# Altium project Thunderscope_Rev2.PrjPCB
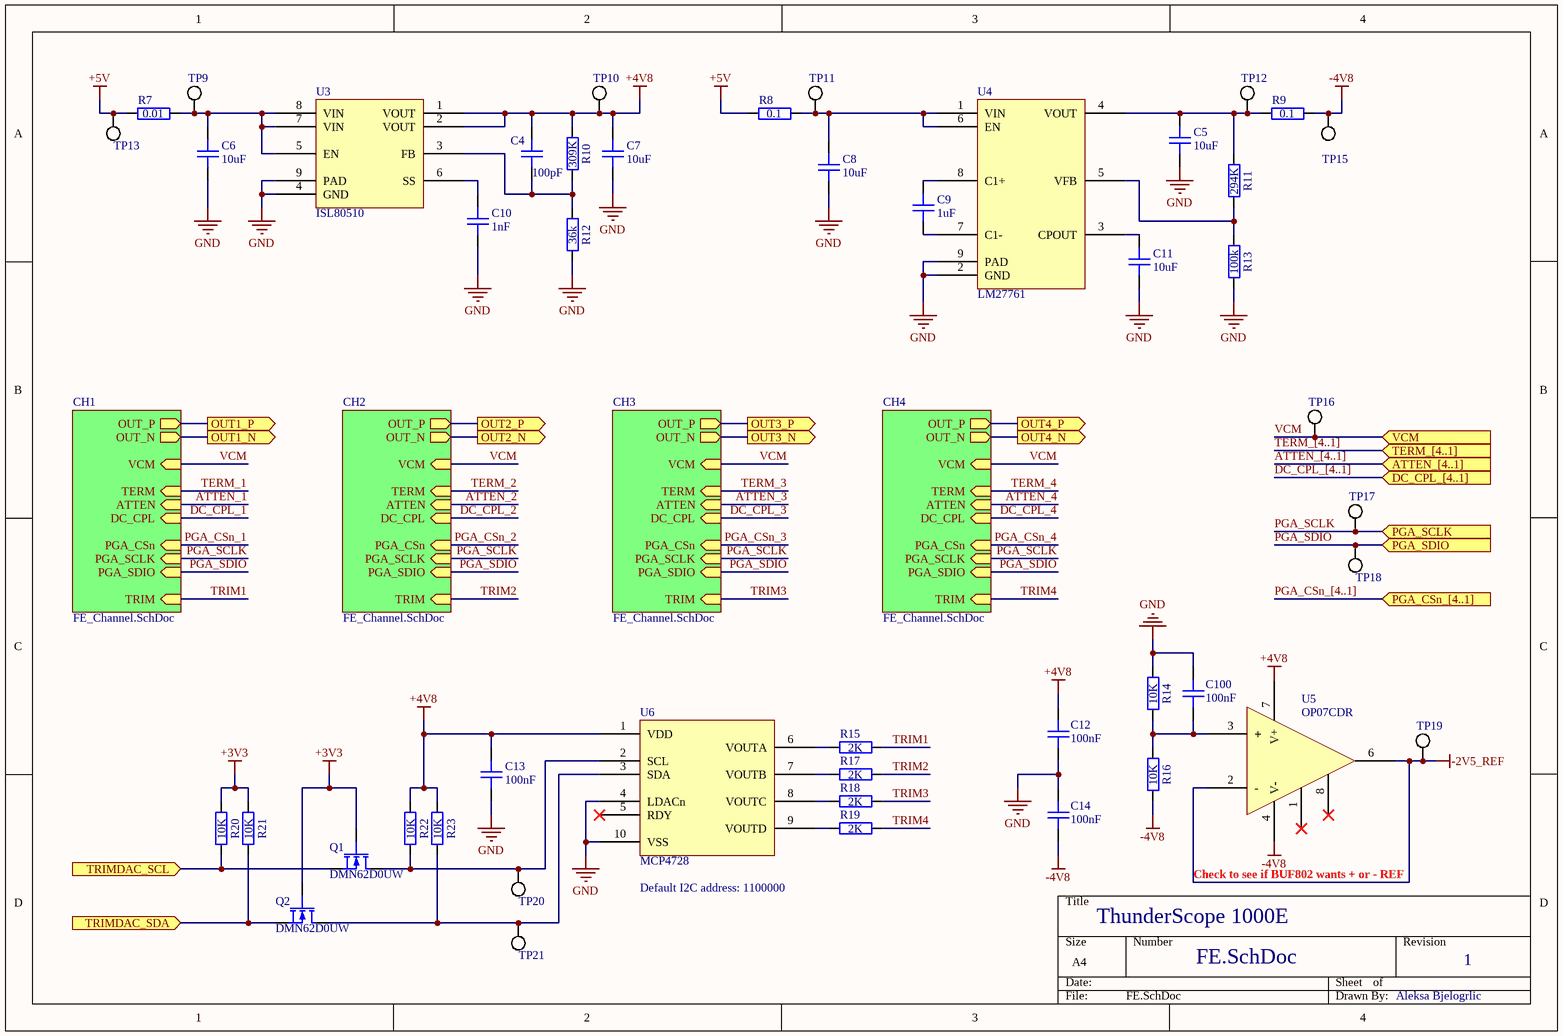
[diagram p0: FE.SchDoc]
Template Notes: - Nominal values used, dimensions in mm  - The mounting holes and keep-out areas around them are only required when the I/O bracket is mounted on the card directly  - Component height rule and clearance rule derived from PCI_Express_CEM_r2.0.pdf, Page 84.  - Stackup is not specified in PCI_Express_CEM_r2.0.pdf, nor implemented in this template.; Template Revision Date: Oct 29, 2010; Template Source Document: Outline:PCI_Express_CEM_r2.0.pdf  Pinout:PCI_Express_CEM_r2.0.pdf; Template Source Organization: PCI-SIG; Template Source Revision Date: R2.0, April 11, 2007; Template Source URL: http://www.pcisig.com; Title: ThunderScope 1000E
4 sheets, 440 parts. Net scope: hierarchical (ports join the sheet entries above them; power ports are global).
Board file: Thunderscope_Rev2.PCBDOC
Sheets:
  FE.SchDoc
    CH1 = FE_Channel.SchDoc
    CH2 = FE_Channel.SchDoc
    CH3 = FE_Channel.SchDoc
    CH4 = FE_Channel.SchDoc
  ADC.SchDoc
  M2_KEY_M.SchDoc

## Sheet FE.SchDoc: ThunderScope 1000E
size A4; Revision: 1

### Parts
C4  100pF  [GEN_C_0402]
C5  10uF  [GEN_C_0603]
C6  10uF  [GEN_C_0603]
C7  10uF  [GEN_C_0603]
C8  10uF  [GEN_C_0603]
C9  1uF  [GEN_C_0402]
C10  1nF  [GEN_C_0402]
C11  10uF  [GEN_C_0603]
C12  100nF  [GEN_C_0402]
C13  100nF  [GEN_C_0402]
C14  100nF  [GEN_C_0402]
C100  100nF  [GEN_C_0402]
Q1  DMN62D0UW  [GEN_SOT_323]
Q2  DMN62D0UW  [GEN_SOT_323]
R7  0.01  [GEN_R_0603]
R8  0.1  [GEN_R_0402]
R9  0.1  [GEN_R_0402]
R10  309K  [GEN_R_0402]
R11  294K  [GEN_R_0402]
R12  36k  [GEN_R_0402]
R13  100k  [GEN_R_0402]
R14  10K  [GEN_R_0402]
R15  2K  [GEN_R_0402]
R16  10K  [GEN_R_0402]
R17  2K  [GEN_R_0402]
R18  2K  [GEN_R_0402]
R19  2K  [GEN_R_0402]
R20  10K  [GEN_R_0402]
R21  10K  [GEN_R_0402]
R22  10K  [GEN_R_0402]
R23  10K  [GEN_R_0402]
TP9  PCB  [GEN_TP_PCB]  (value not drawn)  (no BOM)
TP10  PCB  [GEN_TP_PCB]  (value not drawn)  (no BOM)
TP11  PCB  [GEN_TP_PCB]  (value not drawn)  (no BOM)
TP12  PCB  [GEN_TP_PCB]  (value not drawn)  (no BOM)
TP13  PCB  [GEN_TP_PCB]  (value not drawn)  (no BOM)
TP15  PCB  [GEN_TP_PCB]  (value not drawn)  (no BOM)
TP16  PCB  [GEN_TP_PCB]  (value not drawn)  (no BOM)
TP17  PCB  [GEN_TP_PCB]  (value not drawn)  (no BOM)
TP18  PCB  [GEN_TP_PCB]  (value not drawn)  (no BOM)
TP19  PCB  [GEN_TP_PCB]  (value not drawn)  (no BOM)
TP20  PCB  [GEN_TP_PCB]  (value not drawn)  (no BOM)
TP21  PCB  [GEN_TP_PCB]  (value not drawn)  (no BOM)
U3  ISL80510  [REN_DFN_ISL80510]
U4  LM27761  [TI_WSON8_DSG0008A]
U5  OP07CDR  [TI_SOIC8_D0008A]
U6  MCP4728  [MC_MSOP10_UN]

### Sub-sheets
CH1 = FE_Channel.SchDoc: OUT_P (out), VCM (in), OUT_N (out), TRIM (in), ATTEN (in), DC_CPL (in), PGA_CSn (in), PGA_SCLK (in), PGA_SDIO (in), TERM (in)
CH2 = FE_Channel.SchDoc: OUT_P (out), VCM (in), OUT_N (out), TRIM (in), ATTEN (in), DC_CPL (in), PGA_CSn (in), PGA_SCLK (in), PGA_SDIO (in), TERM (in)
CH3 = FE_Channel.SchDoc: OUT_P (out), VCM (in), OUT_N (out), TRIM (in), ATTEN (in), DC_CPL (in), PGA_CSn (in), PGA_SCLK (in), PGA_SDIO (in), TERM (in)
CH4 = FE_Channel.SchDoc: OUT_P (out), VCM (in), OUT_N (out), TRIM (in), ATTEN (in), DC_CPL (in), PGA_CSn (in), PGA_SCLK (in), PGA_SDIO (in), TERM (in)

### Ports
ATTEN_[4..1] (in), DC_CPL_[4..1] (in), OUT1_N (out), OUT1_P (out), OUT2_N (out), OUT2_P (out), OUT3_N (out), OUT3_P (out), OUT4_N (out), OUT4_P (out), PGA_CSn_[4..1] (in), PGA_SCLK (in), PGA_SDIO (in), TERM_[4..1] (in), TRIMDAC_SCL (in), TRIMDAC_SDA (in), VCM (in)

### Nets
+3V3: Q1.2(G) Q2.2(G) R20.2 R21.2
+4V8: C4.2 C7.2 C12.1 C13.2 R10.2 R22.2 R23.2 TP10.1 U3.1(VOUT) U3.2(VOUT) U5.7(V+) U6.1(VDD)
+5V: R7.1 R8.1 TP13.1
-2V5_REF: TP19.1 U5.2(-) U5.6(OUT)
-4V8: C14.2 R9.2 R16.1 TP15.1 U5.4(V-)
GND: C5.1 C6.1 C7.1 C8.1 C10.1 C11.1 C12.2 C13.1 C14.1 C100.1 R12.1 R13.1 R14.2 U3.4(GND) U3.9(PAD) U4.2(GND) U4.9(PAD) U6.4(LDACn) U6.10(VSS)
OUT1_N: port OUT1_N, sheet CH1/OUT_N
OUT1_P: port OUT1_P, sheet CH1/OUT_P
OUT2_N: port OUT2_N, sheet CH2/OUT_N
OUT2_P: port OUT2_P, sheet CH2/OUT_P
OUT3_N: port OUT3_N, sheet CH3/OUT_N
OUT3_P: port OUT3_P, sheet CH3/OUT_P
OUT4_N: port OUT4_N, sheet CH4/OUT_N
OUT4_P: port OUT4_P, sheet CH4/OUT_P
PGA_SCLK: TP17.1 ; port PGA_SCLK, sheet CH1/PGA_SCLK, sheet CH2/PGA_SCLK, sheet CH3/PGA_SCLK, sheet CH4/PGA_SCLK
PGA_SDIO: TP18.1 ; port PGA_SDIO, sheet CH1/PGA_SDIO, sheet CH2/PGA_SDIO, sheet CH3/PGA_SDIO, sheet CH4/PGA_SDIO
TRIM1: R15.1 ; sheet CH1/TRIM
TRIM2: R17.1 ; sheet CH2/TRIM
TRIM3: R18.1 ; sheet CH3/TRIM
TRIM4: R19.1 ; sheet CH4/TRIM
TRIMDAC_SCL: Q1.3(S) R20.1 ; port TRIMDAC_SCL
TRIMDAC_SDA: Q2.3(S) R21.1 ; port TRIMDAC_SDA
VCM: TP16.1 ; port VCM, sheet CH1/VCM, sheet CH2/VCM, sheet CH3/VCM, sheet CH4/VCM
NetC4_1: C4.1 R10.1 R12.2 U3.3(FB)
NetC5_2: C5.2 R9.1 R11.2 TP12.1 U4.4(VOUT)
NetC6_2: C6.2 R7.2 TP9.1 U3.5(EN) U3.7(VIN) U3.8(VIN)
NetC8_2: C8.2 R8.2 TP11.1 U4.1(VIN) U4.6(EN)
NetC9_1: C9.1 U4.7(C1-)
NetC9_2: C9.2 U4.8(C1+)
NetC10_2: C10.2 U3.6(SS)
NetC11_2: C11.2 U4.3(CPOUT)
NetC100_2: C100.2 R14.1 R16.2 U5.3(+)
NetQ1_1: Q1.1(D) R22.1 TP20.1 U6.2(SCL)
NetQ2_1: Q2.1(D) R23.1 TP21.1 U6.3(SDA)
NetR11_1: R11.1 R13.2 U4.5(VFB)
NetR15_2: R15.2 U6.6(VOUTA)
NetR17_2: R17.2 U6.7(VOUTB)
NetR18_2: R18.2 U6.8(VOUTC)
NetR19_2: R19.2 U6.9(VOUTD)

Not connected (* = marked no-connect by the designer): U5 1(N1)* 8(N2)*; U6 5(RDY)*

### Buses and harness runs
bus ATTEN_[4..1] = port ATTEN_[4..1]
bus DC_CPL_[4..1] = port DC_CPL_[4..1]
bus PGA_CSn_[4..1] = port PGA_CSn_[4..1]
bus TERM_[4..1] = port TERM_[4..1]

### Notes on the sheet
- Default I2C address: 1100000
- Check to see if BUF802 wants + or - REF
- Aleksa Bjelogrlic

### Library data of the parts
C4 = CAP 100pF 50V C0G 0402: Temperature Coefficient: C0G; Voltage Rating: 50V; Package: 0402; Value: 100pF; Supplier 1: Digi-Key; Supplier Part Number 1: 490-14349-1-ND
C5-C8 C11 = CAP 10uF 10V X5R 0603: Voltage Rating: 10V; Package: 0402; Supplier 1: Digi-Key; Supplier Part Number 1: 490-10474-1-ND; Value: 10uF
C9 = CAP 1uF 25V X5R 0402: Voltage Rating: 25V; Package: 0402; Supplier 1: Digi-Key; Supplier Part Number 1: 490-10017-1-ND; Value: 1uF
C10 = CAP 1nF 50V C0G 0402: Voltage Rating: 50V; Package: 0402; Supplier 1: Digi-Key; Supplier Part Number 1: 490-6189-1-ND; Value: 1nF
C12-C14 C100 = CAP 100nF 16V X7R 0402: Voltage Rating: 16V; Package: 0402; Supplier 1: Digi-Key; Supplier Part Number 1: 490-4759-1-ND; Value: 100nF
Q1 Q2 = NMOS DMN62D0UW: Vdss: 60V; Id: 340mA; Max Power: 320mW; Supplier 1: Digi-Key; Supplier Part Number 1: DMN62D0UW-7DICT-ND
R7 = RES 0.01 OHM 1% 1/4W 0603: Tolerance: 1%; Power Rating: 0.25W; Supplier 1: Digi-Key; Supplier Part Number 1: 408-1404-1-ND; Value: 0.01; Package: 0603
R8 R9 = RES 0.1 OHM 1% 1/6W 0402: Tolerance: 1%; Power Rating: 0.16W; Package: 0402; Supplier 1: Digi-Key; Supplier Part Number 1: P.10AKCT-ND; Value: 0.1
R10 = RES 309K OHM 1% 1/16W 0402: Tolerance: 1%; Power Rating: 0.0625W; Package: 0402; Value: 309K; Supplier 1: Digi-Key; Supplier Part Number 1: YAG3108CT-ND
R11 = RES 294K OHM 1% 1/16W 0402: Tolerance: 1%; Power Rating: 0.0625W; Package: 0402; Supplier 1: Digi-Key; Supplier Part Number 1: YAG3092CT-ND; Value: 294K
R12 = RES 36K OHM 1% 1/16W 0402: Tolerance: 1%; Power Rating: 0.0625W; Package: 0402; Value: 36k; Supplier 1: Digi-Key; Supplier Part Number 1: 311-36.0KLRCT-ND
R13 = RES 100K OHM 1% 1/10W 0402: Tolerance: 1%; Power Rating: 0.1W; Package: 0402; Supplier 1: Digi-Key; Supplier Part Number 1: 311-100KLRCT-ND; Value: 100k
R14 R16 R20-R23 = RES 10K OHM 1% 1/10W 0402: Tolerance: 1%; Power Rating: 0.1W; Package: 0402; Supplier 1: Digi-Key; Supplier Part Number 1: P10.0KLCT-ND; Value: 10K
R15 R17-R19 = RES 2K OHM 1% 1/16W 0402: Tolerance: 1%; Power Rating: 0.0625W; Package: 0402; Supplier 1: Digi-Key; Supplier Part Number 1: 311-2KLRCT-ND; Value: 2K
TP9-TP13 TP15-TP21 = TP PCB 1mm
U3 = IC LDO ISL80510: Supplier 1: Mouser; Supplier Part Number 1: 968-ISL80510IRAJZ-T7
U4 = IC CPUMP LM27761: Supplier 1: Digi-Key; Supplier Part Number 1: 296-44379-1-ND
U5 = IC OPAMP OP07CDR: Supplier 1: Digi-Key; Supplier Part Number 1: 296-14626-1-ND
U6 = IC DAC QUAD MCP4728: Supplier 1: Digi-Key; Supplier Part Number 1: MCP4728A1T-E/UNCT-ND

## Sheet FE_Channel.SchDoc: ThunderScope 1000E
size A4; DrawnBy: Aleksa Bjelogrlic; Revision: 1
Used 4 times, as channels CH1, CH2, CH3, CH4. Parts and nets are listed once, with the designators drawn on the sheet.
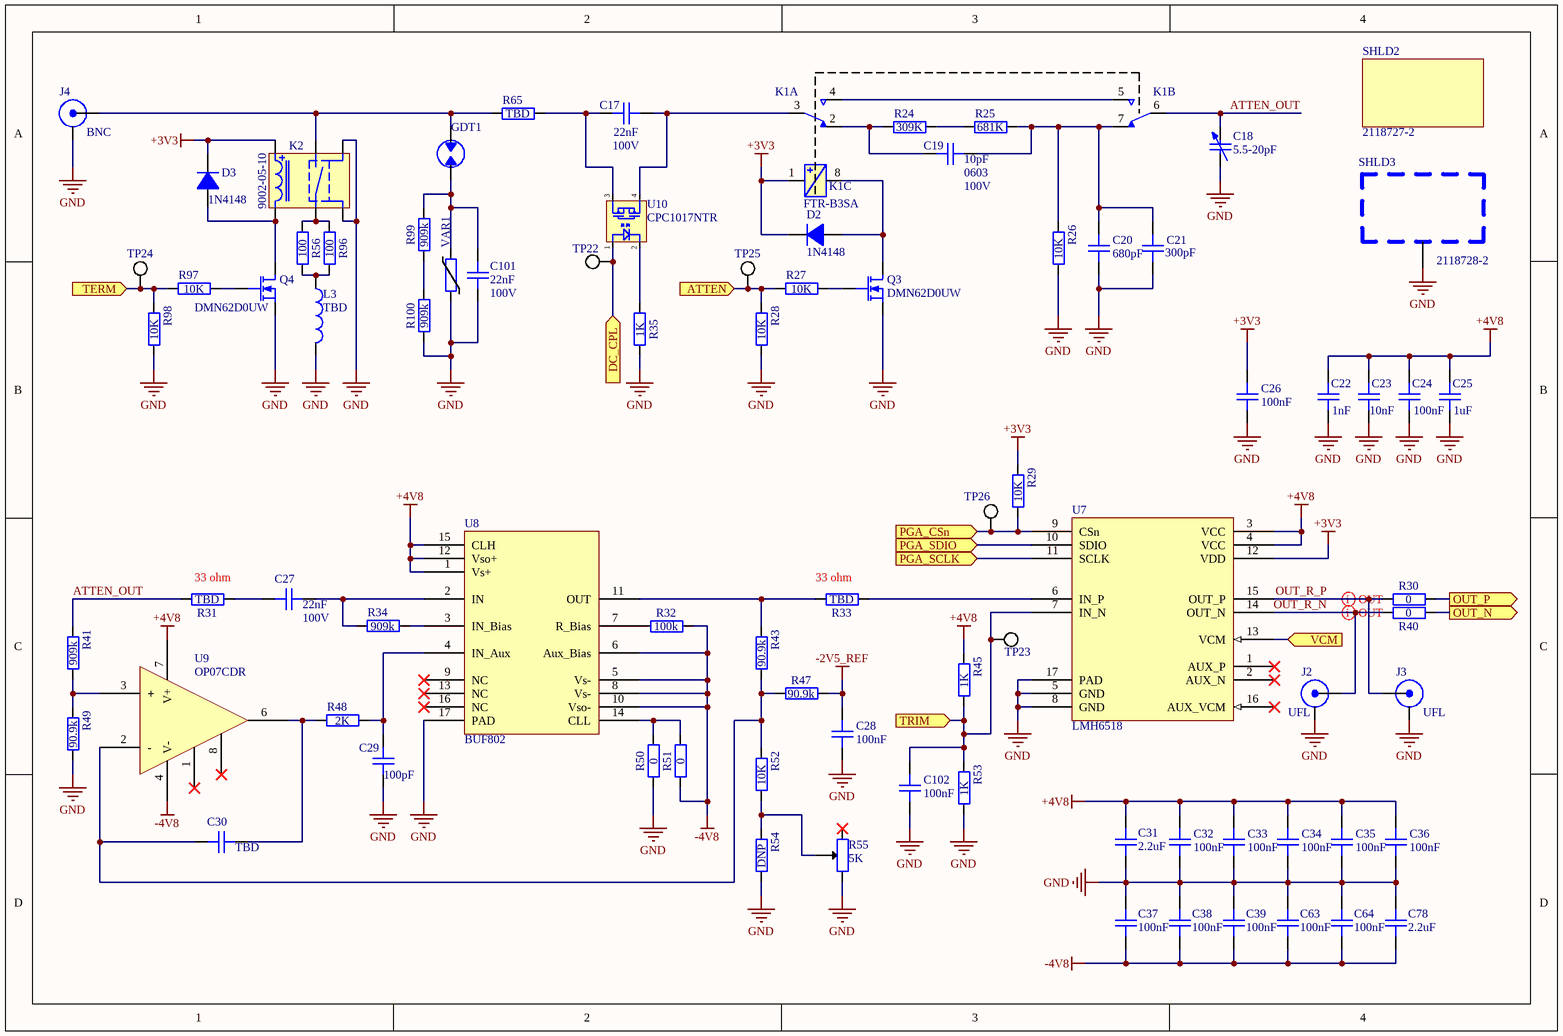
[diagram p1: FE_Channel.SchDoc]

### Parts
C17  22nF  Voltage Rating: 100V  [GEN_C_0603]
C18  5.5-20pF  [EW_TRIMCAP]
C19  10pF  Package: 0603  Voltage Rating: 100V  [GEN_C_0603]
C20  680pF  [GEN_C_0402]
C21  300pF  [GEN_C_0402]
C22  1nF  [GEN_C_0402]
C23  10nF  [GEN_C_0402]
C24  100nF  [GEN_C_0402]
C25  1uF  [GEN_C_0402]
C26  100nF  [GEN_C_0402]
C27  22nF  Voltage Rating: 100V  [GEN_C_0603]
C28  100nF  [GEN_C_0402]
C29  100pF  [GEN_C_0402]
C30  TBD  [GEN_C_0402]
C31  2.2uF  [GEN_C_0402]
C32  100nF  [GEN_C_0402]
C33  100nF  [GEN_C_0402]
C34  100nF  [GEN_C_0402]
C35  100nF  [GEN_C_0402]
C36  100nF  [GEN_C_0402]
C37  100nF  [GEN_C_0402]
C38  100nF  [GEN_C_0402]
C39  100nF  [GEN_C_0402]
C63  100nF  [GEN_C_0402]
C64  100nF  [GEN_C_0402]
C78  2.2uF  [GEN_C_0402]
C101  22nF  Voltage Rating: 100V  [GEN_C_0603]
C102  100nF  [GEN_C_0402]
D2  1N4148  [GEN_SOD_323]
D3  1N4148  [GEN_SOD_323]
GDT1  4532-075-LF  [BOU_2051]  (value not drawn)
J2  UFL  [TE_2334884-1]
J3  UFL  [TE_2334884-1]
J4  BNC  [MOL_0731000105]
K1  FTR-B3SA  [FUJ_FTR-B3SA]  (value not drawn)  (parts A,B,C of 3)
K2  9002-05-10  [COTO_9002-05-10]
L3  TBD  [GEN_L_0402]
Q3  DMN62D0UW  [GEN_SOT_323]
Q4  DMN62D0UW  [GEN_SOT_323]
R24  309K  [GEN_R_0402]
R25  681K  [GEN_R_0402]
R26  10K  [GEN_R_0402]
R27  10K  [GEN_R_0402]
R28  10K  [GEN_R_0402]
R29  10K  [GEN_R_0402]
R30  0  [GEN_R_0402]
R31  TBD  [GEN_R_0402]  (no BOM)
R32  100k  [GEN_R_0402]
R33  TBD  [GEN_R_0402]  (no BOM)
R34  909k  [GEN_R_0402]
R35  1K  [GEN_R_0402]
R40  0  [GEN_R_0402]
R41  909k  [GEN_R_0402]
R43  90.9k  [GEN_R_0402]
R45  1K  [GEN_R_0402]
R47  90.9k  [GEN_R_0402]
R48  2K  [GEN_R_0402]
R49  90.9k  [GEN_R_0402]
R50  0  [GEN_R_0402]
R51  0  [GEN_R_0402]
R52  10K  [GEN_R_0402]
R53  1K  [GEN_R_0402]
R54  DNP  [GEN_R_0402]  (no BOM)
R55  5K  [BOU_3mm_POT]
R56  100  [GEN_R_0402]
R65  TBD  [GEN_R_0603]
R96  100  [GEN_R_0402]
R97  10K  [GEN_R_0402]
R98  10K  [GEN_R_0402]
R99  909k  [GEN_R_0402]
R100  909k  [GEN_R_0402]
SHLD2  2118727-2  (mechanical)
SHLD3  2118728-2  [TE_2118728-2]
TP22  PCB  [GEN_TP_PCB]  (value not drawn)  (no BOM)
TP23  PCB  [GEN_TP_PCB]  (value not drawn)  (no BOM)
TP24  PCB  [GEN_TP_PCB]  (value not drawn)  (no BOM)
TP25  PCB  [GEN_TP_PCB]  (value not drawn)  (no BOM)
TP26  PCB  [GEN_TP_PCB]  (value not drawn)  (no BOM)
U7  LMH6518  [TI_WQFN_RGH0016A]
U8  BUF802  [TI_VQFN_RGT0016C]
U9  OP07CDR  [TI_SOIC8_D0008A]
U10  CPC1017NTR  [IXY_CPC1017]
VAR1  ZV40K1210251NIR1HT  [GEN_VAR_1210]  (value not drawn)

### Ports
ATTEN (in), DC_CPL (in), OUT_N (out), OUT_P (out), PGA_CSn (in), PGA_SCLK (in), PGA_SDIO (in), TERM (in), TRIM (in), VCM (in)

### Nets
+3V3: C26.2 D2.1(K) D3.1(K) K1.1 K2.2 R29.2 U7.12(VDD)
+4V8: C22.2 C23.2 C24.2 C25.2 C31.2 C32.1 C33.1 C34.1 C35.2 C36.2 R45.2 U7.3(VCC) U7.4(VCC) U8.1(Vs+) U8.12(Vso+) U8.15(CLH) U9.7(V+)
-2V5_REF: C28.1 R47.1
-4V8: C37.2 C38.2 C39.1 C63.1 C64.1 C78.2 R32.2 R51.1 U8.5(Vs-) U8.6(Aux_Bias) U8.8(Vs-) U8.10(Vso-) U9.4(V-)
GND: C18.2 C20.1 C21.1 C22.1 C23.1 C24.1 C25.1 C26.1 C28.2 C29.1 C31.1 C32.2 C33.2 C34.2 C35.1 C36.1 C37.1 C38.1 C39.2 C63.2 C64.2 C78.1 C101.2 C102.2 J2.2(SHIELD) J3.2(SHIELD) J4.2(SHIELD) K2.5 K2.6 L3.2 Q3.3(S) Q4.3(S) R26.1 R28.1 R35.1 R49.1 R50.1 R53.1 R54.1 R55.3 R98.1 R100.1 SHLD3.1 U7.5(GND) U7.8(GND) U7.17(PAD) U8.17(PAD) VAR1.1
ATTEN: R27.2 R28.2 TP25.1 ; port ATTEN
ATTEN_OUT: C18.1 K1.6 R31.1 R41.2
DC_CPL: TP22.1 U10.1 ; port DC_CPL
OUT_N: R40.2 ; port OUT_N
OUT_P: R30.2 ; port OUT_P
OUT_R_N: J2.1(Signal) R40.1 U7.14(OUT_N)
OUT_R_P: J3.1(Signal) R30.1 U7.15(OUT_P)
PGA_CSn: R29.1 TP26.1 U7.9(CSn) ; port PGA_CSn
PGA_SCLK: U7.11(SCLK) ; port PGA_SCLK
PGA_SDIO: U7.10(SDIO) ; port PGA_SDIO
TERM: R97.2 R98.2 TP24.1 ; port TERM
TRIM: C102.1 R45.1 R53.2 TP23.1 U7.7(IN_N) ; port TRIM
VCM: U7.13(VCM) ; port VCM
NetC17_1: C17.1 K1.3 U10.4
NetC17_2: C17.2 R65.2 U10.3
NetC19_1: C19.1 C20.2 C21.2 K1.7 R25.2 R26.2
NetC19_2: C19.2 K1.2 R24.1
NetC27_1: C27.1 R34.2 U8.2(IN)
NetC27_2: C27.2 R31.2
NetC29_2: C29.2 R48.1 U8.4(IN_Aux)
NetC30_1: C30.1 R48.2 U9.6(OUT)
NetC30_2: C30.2 R43.1 R47.2 R52.2 U9.2(-)
NetC101_1: C101.1 GDT1.2 R99.2 VAR1.2
NetD2_2: D2.2(A) K1.8 Q3.1(D)
NetD3_2: D3.2(A) K2.3 Q4.1(D)
NetGDT1_1: GDT1.1 J4.1(Signal) K2.1 R65.1
NetK1_4: K1.4 K1.5
NetK2_4: K2.4 R56.2 R96.2
NetL3_1: L3.1 R56.1 R96.1
NetQ3_2: Q3.2(G) R27.1
NetQ4_2: Q4.2(G) R97.1
NetR24_2: R24.2 R25.1
NetR32_1: R32.1 U8.7(R_Bias)
NetR33_1: R33.1 R43.2 U8.11(OUT)
NetR33_2: R33.2 U7.6(IN_P)
NetR34_1: R34.1 U8.3(IN_Bias)
NetR35_2: R35.2 U10.2
NetR41_1: R41.1 R49.2 U9.3(+)
NetR50_2: R50.2 R51.2 U8.14(CLL)
NetR52_1: R52.1 R54.2 R55.2
NetR99_1: R99.1 R100.2

Not connected (* = marked no-connect by the designer): R55 1*; U7 1(AUX_P)* 2(AUX_N)* 16(AUX_VCM)*; U8 9(NC)* 13(NC)* 16(NC)*; U9 1(N1)* 8(N2)*

### Channels
CH1: designators end in A; ports ATTEN=ATTEN_1 DC_CPL=DC_CPL_1 OUT_N=OUT1_N OUT_P=OUT1_P PGA_CSn=PGA_CSn_1 PGA_SCLK=PGA_SCLK PGA_SDIO=PGA_SDIO TERM=TERM_1 TRIM=TRIM1 VCM=VCM
CH2: designators end in B; ports ATTEN=ATTEN_2 DC_CPL=DC_CPL_2 OUT_N=OUT2_N OUT_P=OUT2_P PGA_CSn=PGA_CSn_2 PGA_SCLK=PGA_SCLK PGA_SDIO=PGA_SDIO TERM=TERM_2 TRIM=TRIM2 VCM=VCM
CH3: designators end in C; ports ATTEN=ATTEN_3 DC_CPL=DC_CPL_3 OUT_N=OUT3_N OUT_P=OUT3_P PGA_CSn=PGA_CSn_3 PGA_SCLK=PGA_SCLK PGA_SDIO=PGA_SDIO TERM=TERM_3 TRIM=TRIM3 VCM=VCM
CH4: designators end in D; ports ATTEN=ATTEN_4 DC_CPL=DC_CPL_4 OUT_N=OUT4_N OUT_P=OUT4_P PGA_CSn=PGA_CSn_4 PGA_SCLK=PGA_SCLK PGA_SDIO=PGA_SDIO TERM=TERM_4 TRIM=TRIM4 VCM=VCM

### Layout directives
differential pair; differential pair class 100Z_Diff_PGA: OUT_R_N_CH1, OUT_R_P_CH1

### Notes on the sheet
- (near R31) 33 ohm
- (near R33) 33 ohm

### Library data of the parts
C17 C27 C101 = CAP 22nF 100V X7R 0603: Package: 0603; Supplier 1: Digi-Key; Supplier Part Number 1: 490-4782-1-ND; Value: 22nF
C18 = CAP TRIMMER 5.5-20PF 500V: Value: 5.5-20pF; Supplier 1: Digikey; Supplier Part Number 1: 2447-SGC3S200NMCT-ND
C19 = CAP 10pF 100V C0G 0603: Supplier 1: Digi-Key; Supplier Part Number 1: 478-5769-1-ND; Value: 10pF
C20 = CAP 680pF 50V C0G 0402: Voltage Rating: 50V; Temperature Coefficient: C0G; Package: 0402; Supplier 1: Digi-Key; Supplier Part Number 1: 490-16439-1-ND; Value: 680pF
C21 = CAP 300pF 50V C0G 0402: Voltage Rating: 50V; Temperature Coefficient: C0G; Package: 0402; Supplier 1: Digi-Key; Supplier Part Number 1: 490-GCM1555C1H301FA16DCT-ND; Value: 300pF
C22 = CAP 1nF 50V C0G 0402: Voltage Rating: 50V; Package: 0402; Supplier 1: Digi-Key; Supplier Part Number 1: 490-6189-1-ND; Value: 1nF
C23 = CAP 10nF 50V X7R 0402: Voltage Rating: 50V; Package: 0402; Supplier 1: Digi-Key; Supplier Part Number 1: 490-6351-1-ND; Value: 10nF
C24 C26 C28 C32-C39 C63 C64 C102 = CAP 100nF 16V X7R 0402: Voltage Rating: 16V; Package: 0402; Supplier 1: Digi-Key; Supplier Part Number 1: 490-4759-1-ND; Value: 100nF
C25 = CAP 1uF 25V X5R 0402: Voltage Rating: 25V; Package: 0402; Supplier 1: Digi-Key; Supplier Part Number 1: 490-10017-1-ND; Value: 1uF
C29 = CAP 100pF 50V C0G 0402: as C4 on sheet FE; Package: 0402; Value: 100pF; Supplier 1: Digi-Key; Supplier Part Number 1: 490-14349-1-ND
C30 = CAP TBD 0402: Package: 0402; Value: TBD
C31 C78 = CAP 2.2uF 10V X5R 0402: Voltage Rating: 10V; Package: 0402; Supplier 1: Digi-Key; Supplier Part Number 1: 587-3153-1-ND; Value: 2.2uF
D2 D3 = DIODE 1N4148: Max Reverse Voltage: 75V; Max Current: 150mA; Supplier 1: Digi-Key; Supplier Part Number 1: 1N4148WS-FDICT-ND
GDT1 = GDT 75V 1812: Supplier 1: Digi-Key; Supplier Part Number 1: YAG6774CT-ND
J2 J3 = UFL Jack SMD: Supplier 1: Digi-Key; Supplier Part Number 1: A145155CT-ND
J4 = BNC JACK R/A: Supplier 1: Digi-Key; Supplier Part Number 1: WM5524-ND
K1 = RELAY DPDT-NO FTR-B3SA: Supplier 1: Mouser; Supplier Part Number 1: 817-FTR-B3SA003Z
K2 = RELAY RF SPST-NO 9002-05-10: Supplier 1: Newark; Supplier Part Number 1: 11J0051
L3 = IND TBD 0402: Value: TBD
Q3 Q4 = NMOS DMN62D0UW: Vdss: 60V; Id: 340mA; Max Power: 320mW; Supplier 1: Digi-Key; Supplier Part Number 1: DMN62D0UW-7DICT-ND
R24 = RES 309K OHM 1% 1/16W 0402: Tolerance: 1%; Power Rating: 0.0625W; Package: 0402; Supplier 1: Digi-Key; Supplier Part Number 1: YAG3108CT-ND; Value: 309K
R25 = RES 681K OHM 1% 1/16W 0402: Tolerance: 1%; Power Rating: 0.0625W; Package: 0402; Supplier 1: Digi-Key; Supplier Part Number 1: YAG3212CT-ND; Value: 681K
R26-R29 R52 R97 R98 = RES 10K OHM 1% 1/10W 0402: Tolerance: 1%; Power Rating: 0.1W; Package: 0402; Supplier 1: Digi-Key; Supplier Part Number 1: P10.0KLCT-ND; Value: 10K
R30 R40 R50 R51 = RES 0 OHM 1/16W 0402: Power Rating: 0.0625W; Package: 0402; Supplier 1: Digi-Key; Supplier Part Number 1: 311-0.0JRCT-ND; Value: 0
R31 R33 = RES TBD 0402: Tolerance: 1%; Power Rating: 0.0625W; Package: 0402; Value: TBD
R32 = RES 100K OHM 1% 1/10W 0402: Tolerance: 1%; Power Rating: 0.1W; Package: 0402; Value: 100k; Supplier 1: Digi-Key; Supplier Part Number 1: 311-100KLRCT-ND
R34 R41 R99 R100 = RES 909K OHM 1% 1/16W 0402: Tolerance: 1%; Power Rating: 0.0625W; Package: 0402; Supplier 1: Digi-Key; Supplier Part Number 1: YAG2377CT-ND; Value: 909k
R35 R45 R53 = RES 1K OHM 1% 1/10W 0402: Tolerance: 1%; Power Rating: 0.1W; Package: 0402; Supplier 1: Digi-Key; Supplier Part Number 1: 311-1.00KLRCT-ND; Value: 1K
R43 R47 R49 = RES 90.9K OHM 1% 1/16W 0402: Tolerance: 1%; Power Rating: 0.0625W; Package: 0402; Supplier 1: Digi-Key; Supplier Part Number 1: 311-90.9KLRCT-ND; Value: 90.9k
R48 = RES 2K OHM 1% 1/16W 0402: Tolerance: 1%; Power Rating: 0.0625W; Package: 0402; Supplier 1: Digi-Key; Supplier Part Number 1: 311-2KLRCT-ND; Value: 2K
R54 = RES DNP 0402: Tolerance: 1%; Power Rating: 0.0625W; Package: 0402; Value: DNP
R55 = TRIMMER 5K OHM 0.1W J LEAD TOP: Tolerance: 1%; Power Rating: 0.1W; Supplier 1: Digi-Key; Supplier Part Number 1: TC33X-502ECT-ND; Value: 5K
R56 R96 = RES 100 OHM 1% 1/10W 0402: Tolerance: 1%; Power Rating: 0.1W; Package: 0402; Value: 100; Supplier 1: Digi-Key; Supplier Part Number 1: 2019-RK73H1ETTP1000FCT-ND
R65 = RES TBD 0603: Value: TBD; Package: 0603
SHLD2 = SHIELD 2118727-2: Supplier 1: Digi-Key; Supplier Part Number 1: A126132-ND
SHLD3 = SHIELD 2118728-2: Supplier 1: Digi-Key; Supplier Part Number 1: A126158CT-ND
TP22-TP26 = TP PCB 1mm
U7 = IC PGA LMH6518: Supplier 1: Digi-Key; Supplier Part Number 1: LMH6518SQE/NOPBCT-ND
U8 = IC BUFFER AMP BUF802: Supplier 1: Mouser; Supplier Part Number 1: 595-BUF802IRGTR
U9 = IC OPAMP OP07CDR: Supplier 1: Digi-Key; Supplier Part Number 1: 296-14626-1-ND
U10 = SSR CPC1017NTR: Supplier 1: Digi-Key; Supplier Part Number 1: CLA233CT-ND
VAR1 = VARISTOR 68V 250A 1210: Supplier 1: Digi-Key; Supplier Part Number 1: 118-ZV40K1210251NIR1HTCT-ND

## Sheet ADC.SchDoc: ThunderScope 1000E
size A4; DrawnBy: Aleksa Bjelogrlic; Revision: 1
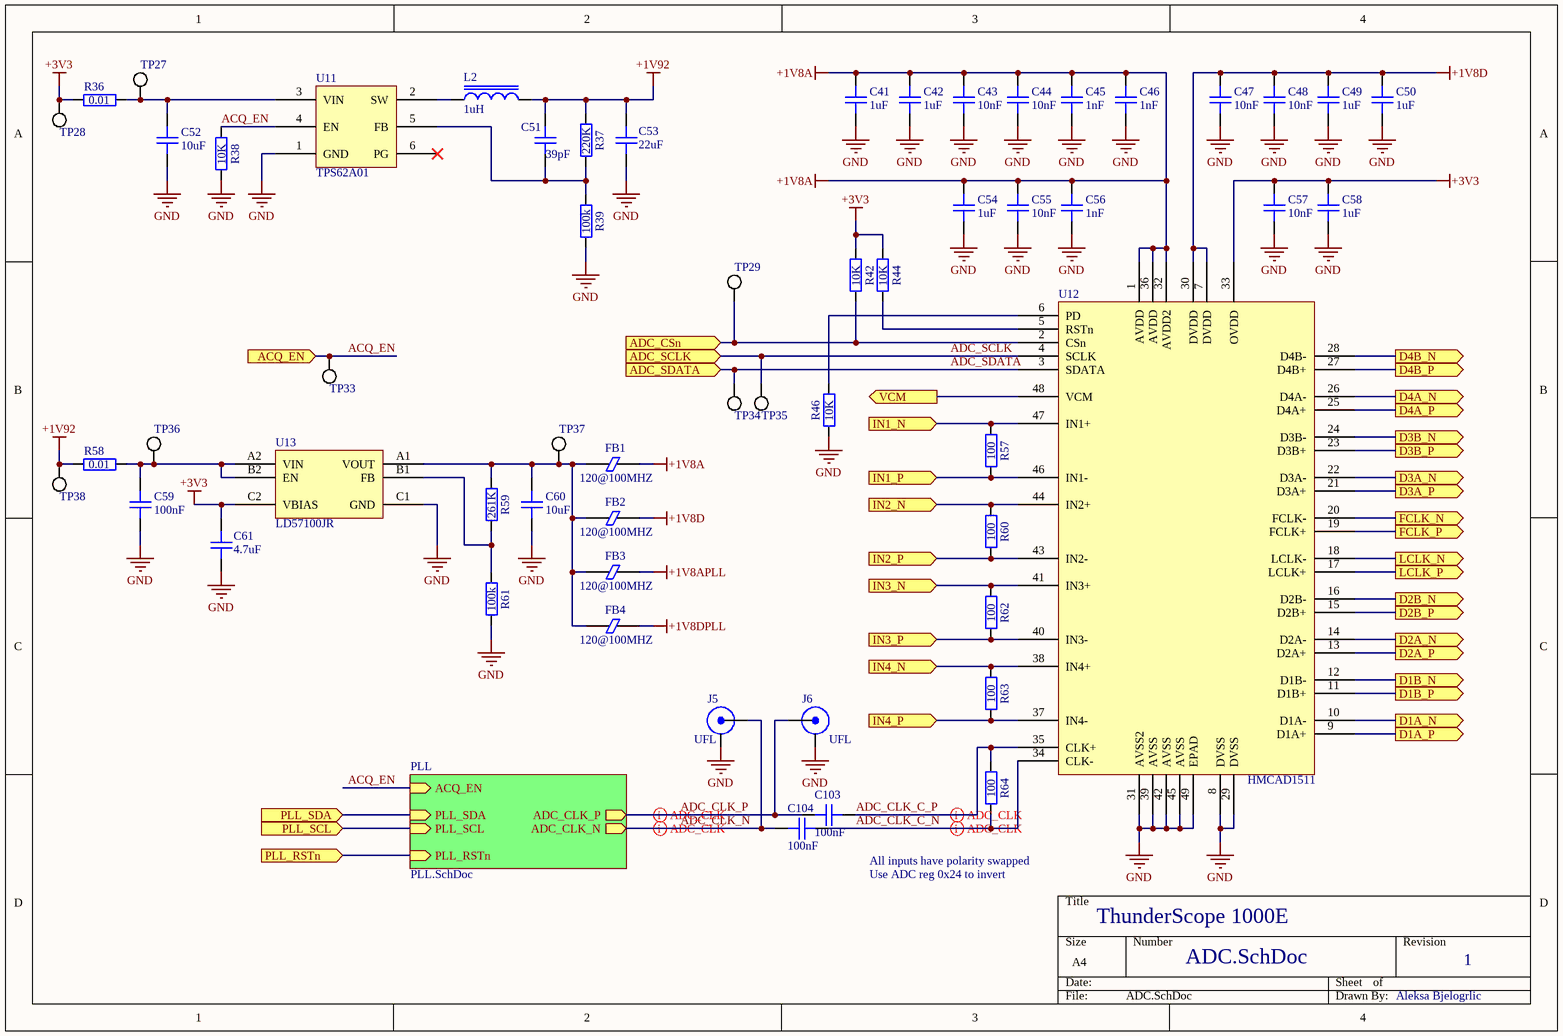
[diagram p2: ADC.SchDoc]

### Parts
C41  1uF  [GEN_C_0402]
C42  1uF  [GEN_C_0402]
C43  10nF  [GEN_C_0402]
C44  10nF  [GEN_C_0402]
C45  1nF  [GEN_C_0402]
C46  1nF  [GEN_C_0402]
C47  10nF  [GEN_C_0402]
C48  10nF  [GEN_C_0402]
C49  1uF  [GEN_C_0402]
C50  1uF  [GEN_C_0402]
C51  39pF  [GEN_C_0402]
C52  10uF  [GEN_C_0603]
C53  22uF  [GEN_C_0805]
C54  1uF  [GEN_C_0402]
C55  10nF  [GEN_C_0402]
C56  1nF  [GEN_C_0402]
C57  10nF  [GEN_C_0402]
C58  1uF  [GEN_C_0402]
C59  100nF  [GEN_C_0402]
C60  10uF  [GEN_C_0603]
C61  4.7uF  [GEN_C_0402]
C103  100nF  [GEN_C_0402]
C104  100nF  [GEN_C_0402]
FB1  120@100MHZ  [GEN_R_0402]
FB2  120@100MHZ  [GEN_R_0402]
FB3  120@100MHZ  [GEN_R_0402]
FB4  120@100MHZ  [GEN_R_0402]
J5  UFL  [TE_2334884-1]
J6  UFL  [TE_2334884-1]
L2  1uH  [GEN_L_1210]
R36  0.01  [GEN_R_0603]
R37  220K  [GEN_R_0402]
R38  10K  [GEN_R_0402]
R39  100k  [GEN_R_0402]
R42  10K  [GEN_R_0402]
R44  10K  [GEN_R_0402]
R46  10K  [GEN_R_0402]
R57  100  [GEN_R_0402]
R58  0.01  [GEN_R_0603]
R59  261K  [GEN_R_0402]
R60  100  [GEN_R_0402]
R61  100k  [GEN_R_0402]
R62  100  [GEN_R_0402]
R63  100  [GEN_R_0402]
R64  100  [GEN_R_0402]
TP27  PCB  [GEN_TP_PCB]  (value not drawn)  (no BOM)
TP28  PCB  [GEN_TP_PCB]  (value not drawn)  (no BOM)
TP29  PCB  [GEN_TP_PCB]  (value not drawn)  (no BOM)
TP33  PCB  [GEN_TP_PCB]  (value not drawn)  (no BOM)
TP34  PCB  [GEN_TP_PCB]  (value not drawn)  (no BOM)
TP35  PCB  [GEN_TP_PCB]  (value not drawn)  (no BOM)
TP36  PCB  [GEN_TP_PCB]  (value not drawn)  (no BOM)
TP37  PCB  [GEN_TP_PCB]  (value not drawn)  (no BOM)
TP38  PCB  [GEN_TP_PCB]  (value not drawn)  (no BOM)
U11  TPS62A01  [TI_SOT563_DRL0006A]
U12  HMCAD1511  [AD_QFN48_LP7]
U13  LD57100JR  [ST_FlipChip6]

### Sub-sheets
PLL = PLL.SchDoc (file not in this document): ADC_CLK_P (out), ADC_CLK_N (out), PLL_RSTn (in), PLL_SDA (in), PLL_SCL (in), ACQ_EN (in)

### Ports
ACQ_EN (in), ADC_CSn (in), ADC_SCLK (in), ADC_SDATA (in), D1A_N (out), D1A_P (out), D1B_N (out), D1B_P (out), D2A_N (out), D2A_P (out), D2B_N (out), D2B_P (out), D3A_N (out), D3A_P (out), D3B_N (out), D3B_P (out), D4A_N (out), D4A_P (out), D4B_N (out), D4B_P (out), FCLK_N (out), FCLK_P (out), IN1_N (in), IN1_P (in), IN2_N (in), IN2_P (in), IN3_N (in), IN3_P (in), IN4_N (in), IN4_P (in), LCLK_N (out), LCLK_P (out), PLL_RSTn (in), PLL_SCL (in), PLL_SDA (in), VCM (out)

### Nets
+1V8A: C41.2 C42.2 C43.2 C44.2 C45.2 C46.2 C54.2 C55.2 C56.2 FB1.2 U12.1(AVDD) U12.32(AVDD2) U12.36(AVDD)
+1V8APLL: FB3.2
+1V8D: C47.2 C48.2 C49.2 C50.2 FB2.2 U12.7(DVDD) U12.30(DVDD)
+1V8DPLL: FB4.2
+1V92: C51.2 C53.2 L2.2 R37.2 R58.1 TP38.1
+3V3: C57.2 C58.2 C61.2 R36.1 R42.2 R44.2 TP28.1 U12.33(OVDD) U13.C2(VBIAS)
GND: C41.1 C42.1 C43.1 C44.1 C45.1 C46.1 C47.1 C48.1 C49.1 C50.1 C52.1 C53.1 C54.1 C55.1 C56.1 C57.1 C58.1 C59.1 C60.1 C61.1 J5.2(SHIELD) J6.2(SHIELD) R38.1 R39.1 R46.2 R61.1 U11.1(GND) U12.8(DVSS) U12.29(DVSS) U12.31(AVSS2) U12.39(AVSS) U12.42(AVSS) U12.45(AVSS) U12.49(EPAD) U13.C1(GND)
ACQ_EN: R38.2 TP33.1 U11.4(EN) ; port ACQ_EN, sheet PLL/ACQ_EN
ADC_CLK_C_N: C104.1 R64.1 U12.34(CLK-)
ADC_CLK_C_P: C103.1 R64.2 U12.35(CLK+)
ADC_CLK_N: C104.2 J5.1(Signal) ; sheet PLL/ADC_CLK_N
ADC_CLK_P: C103.2 J6.1(Signal) ; sheet PLL/ADC_CLK_P
ADC_CSn: R42.1 TP29.1 U12.2(CSn) ; port ADC_CSn
ADC_SCLK: TP35.1 U12.4(SCLK) ; port ADC_SCLK
ADC_SDATA: TP34.1 U12.3(SDATA) ; port ADC_SDATA
D1A_N: U12.10(D1A-) ; port D1A_N
D1A_P: U12.9(D1A+) ; port D1A_P
D1B_N: U12.12(D1B-) ; port D1B_N
D1B_P: U12.11(D1B+) ; port D1B_P
D2A_N: U12.14(D2A-) ; port D2A_N
D2A_P: U12.13(D2A+) ; port D2A_P
D2B_N: U12.16(D2B-) ; port D2B_N
D2B_P: U12.15(D2B+) ; port D2B_P
D3A_N: U12.22(D3A-) ; port D3A_N
D3A_P: U12.21(D3A+) ; port D3A_P
D3B_N: U12.24(D3B-) ; port D3B_N
D3B_P: U12.23(D3B+) ; port D3B_P
D4A_N: U12.26(D4A-) ; port D4A_N
D4A_P: U12.25(D4A+) ; port D4A_P
D4B_N: U12.28(D4B-) ; port D4B_N
D4B_P: U12.27(D4B+) ; port D4B_P
FCLK_N: U12.20(FCLK-) ; port FCLK_N
FCLK_P: U12.19(FCLK+) ; port FCLK_P
IN1_N: R57.2 U12.47(IN1+) ; port IN1_N
IN1_P: R57.1 U12.46(IN1-) ; port IN1_P
IN2_N: R60.2 U12.44(IN2+) ; port IN2_N
IN2_P: R60.1 U12.43(IN2-) ; port IN2_P
IN3_N: R62.2 U12.41(IN3+) ; port IN3_N
IN3_P: R62.1 U12.40(IN3-) ; port IN3_P
IN4_N: R63.2 U12.38(IN4+) ; port IN4_N
IN4_P: R63.1 U12.37(IN4-) ; port IN4_P
LCLK_N: U12.18(LCLK-) ; port LCLK_N
LCLK_P: U12.17(LCLK+) ; port LCLK_P
PLL_RSTn: port PLL_RSTn, sheet PLL/PLL_RSTn
PLL_SCL: port PLL_SCL, sheet PLL/PLL_SCL
PLL_SDA: port PLL_SDA, sheet PLL/PLL_SDA
VCM: U12.48(VCM) ; port VCM
NetC51_1: C51.1 R37.1 R39.2 U11.5(FB)
NetC52_2: C52.2 R36.2 TP27.1 U11.3(VIN)
NetC59_2: C59.2 R58.2 TP36.1 U13.A2(VIN) U13.B2(EN)
NetC60_2: C60.2 FB1.1 FB2.1 FB3.1 FB4.1 R59.2 TP37.1 U13.A1(VOUT)
NetL2_1: L2.1 U11.2(SW)
NetR44_1: R44.1 U12.5(RSTn)
NetR46_1: R46.1 U12.6(PD)
NetR59_1: R59.1 R61.2 U13.B1(FB)

Not connected (* = marked no-connect by the designer): U11 6(PG)*

### Layout directives
differential pair: ADC_CLK_C_N, ADC_CLK_C_P, ADC_CLK_N, ADC_CLK_P

### Notes on the sheet
- All inputs have polarity swapped
- Use ADC reg 0x24 to invert
- Aleksa Bjelogrlic

### Library data of the parts
C41 C42 C49 C50 C54 C58 = CAP 1uF 25V X5R 0402: Voltage Rating: 25V; Package: 0402; Supplier 1: Digi-Key; Supplier Part Number 1: 490-10017-1-ND; Value: 1uF
C43 C44 C47 C48 C55 C57 = CAP 10nF 50V X7R 0402: Voltage Rating: 50V; Package: 0402; Supplier 1: Digi-Key; Supplier Part Number 1: 490-6351-1-ND; Value: 10nF
C45 C46 C56 = CAP 1nF 50V C0G 0402: Voltage Rating: 50V; Package: 0402; Supplier 1: Digi-Key; Supplier Part Number 1: 490-6189-1-ND; Value: 1nF
C51 = CAP 39pF 50V C0G 0402: Temperature Coefficient: C0G; Voltage Rating: 50V; Package: 0402; Value: 39pF; Supplier 1: Digi-Key; Supplier Part Number 1: 399-C0402C390J5GAC7867CT-ND
C52 C60 = CAP 10uF 10V X5R 0603: Voltage Rating: 10V; Package: 0402; Supplier 1: Digi-Key; Supplier Part Number 1: 490-10474-1-ND; Value: 10uF
C53 = CAP 22uF 25V X5R 0805: Voltage Rating: 25V; Package: 0805; Value: 22uF; Supplier 1: Digi-Key; Supplier Part Number 1: 490-10749-1-ND
C59 C103 C104 = CAP 100nF 16V X7R 0402: Voltage Rating: 16V; Package: 0402; Supplier 1: Digi-Key; Supplier Part Number 1: 490-4759-1-ND; Value: 100nF
C61 = CAP 4.7uF 6.3V X5R 0402: Voltage Rating: 6.3V; Package: 0402; Value: 4.7uF; Supplier 1: Digi-Key; Supplier Part Number 1: 490-5915-1-ND
FB1-FB4 = FERRITE BEAD 120 OHM 0402: Supplier 1: Digi-Key; Supplier Part Number 1: 490-9656-1-ND
J5 J6 = UFL Jack SMD: Supplier 1: Digi-Key; Supplier Part Number 1: A145155CT-ND
L2 = IND 1uH 3.1A 45 MOHM 1210: Value: 1uH; Supplier 1: Digi-Key; Supplier Part Number 1: 490-10590-1-ND
R36 R58 = RES 0.01 OHM 1% 1/4W 0603: Tolerance: 1%; Power Rating: 0.25W; Supplier 1: Digi-Key; Supplier Part Number 1: 408-1404-1-ND; Value: 0.01; Package: 0603
R37 = RES 220K OHM 1% 1/16W 0402: Tolerance: 1%; Power Rating: 0.0625W; Package: 0402; Value: 220K; Supplier 1: Digi-Key; Supplier Part Number 1: 311-220KLRCT-ND
R38 R42 R44 R46 = RES 10K OHM 1% 1/10W 0402: Tolerance: 1%; Power Rating: 0.1W; Package: 0402; Supplier 1: Digi-Key; Supplier Part Number 1: P10.0KLCT-ND; Value: 10K
R39 R61 = RES 100K OHM 1% 1/10W 0402: Tolerance: 1%; Power Rating: 0.1W; Package: 0402; Value: 100k; Supplier 1: Digi-Key; Supplier Part Number 1: 311-100KLRCT-ND
R57 R60 R62-R64 = RES 100 OHM 1% 1/10W 0402: Tolerance: 1%; Power Rating: 0.1W; Package: 0402; Value: 100; Supplier 1: Digi-Key; Supplier Part Number 1: 2019-RK73H1ETTP1000FCT-ND
R59 = RES 261K OHM 1% 1/16W 0402: Tolerance: 1%; Power Rating: 0.0625W; Package: 0402; Value: 261K; Supplier 1: Digi-Key; Supplier Part Number 1: 311-261KLRCT-ND
TP27-TP29 TP33-TP38 = TP PCB 1mm
U11 = IC BUCK TPS62A01: Supplier 1: Mouser; Supplier Part Number 1: 595-TPS62A01DRLR
U12 = IC ADC HMCAD1511: Supplier 1: Digi-Key; Supplier Part Number 1: 1127-1648-ND
U13 = IC LDO LD57100JR: Supplier 1: Digi-Key; Supplier Part Number 1: 497-LD57100JRCT-ND

## Sheet M2_KEY_M.SchDoc: ThunderScope 1000E
size A4
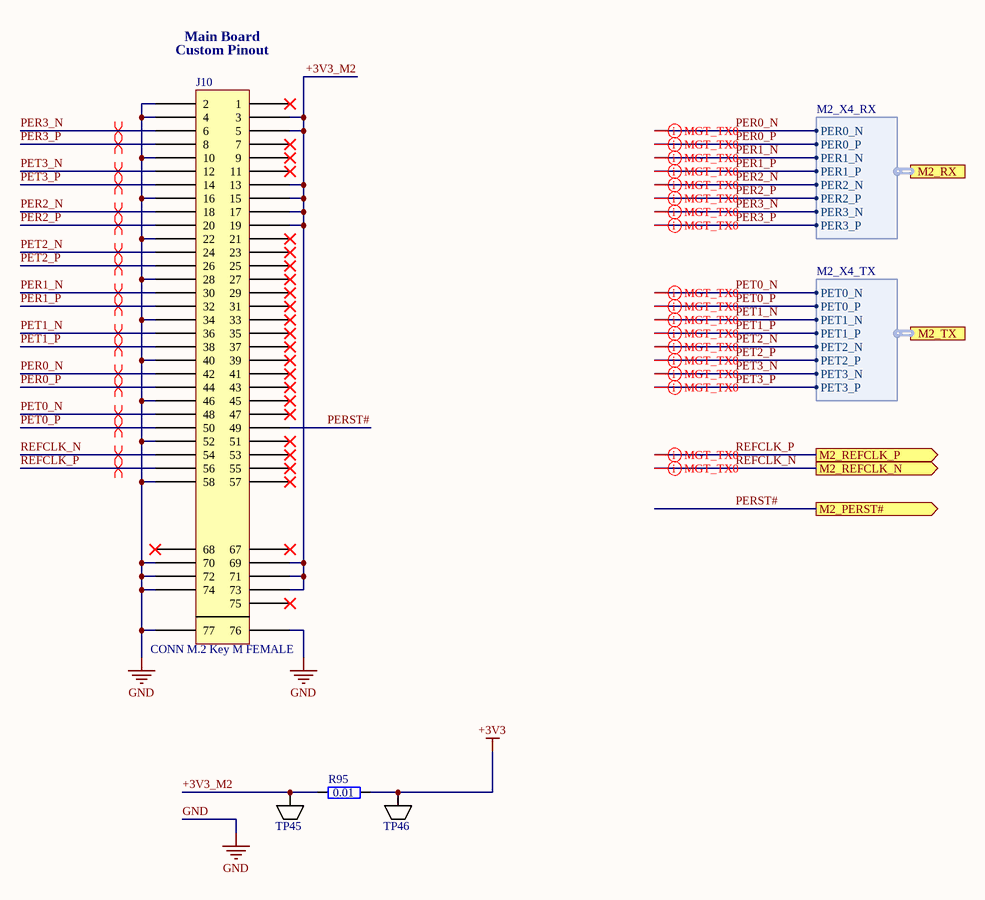
[diagram p3: M2_KEY_M.SchDoc]

### Parts
J10  CONN M.2 Key M FEMALE  [TE_M2_KEYM_2199230]
R95  0.01  [GEN_R_0603]
TP45  5015  [KEY_5015]  (value not drawn)
TP46  5015  [KEY_5015]  (value not drawn)

### Ports
M2_PERST# (out), M2_REFCLK_N (out), M2_REFCLK_P (out), M2_RX (harness M2_X4_RX), M2_TX (harness M2_X4_TX)

### Harnesses
M2_X4_RX: PER0_N, PER0_P, PER1_N, PER1_P, PER2_N, PER2_P, PER3_N, PER3_P
M2_X4_TX: PET0_N, PET0_P, PET1_N, PET1_P, PET2_N, PET2_P, PET3_N, PET3_P

### Nets
+3V3: R95.2 TP46.1
GND: J10.2 J10.4 J10.10 J10.16 J10.22 J10.28 J10.34 J10.40 J10.46 J10.52 J10.58 J10.70 J10.72 J10.74 J10.76 J10.77
+3V3_M2: J10.3 J10.5 J10.13 J10.15 J10.17 J10.19 J10.69 J10.71 J10.73 R95.1 TP45.1
PER0_N: J10.42 ; port M2_RX.PER0_N
PER0_P: J10.44 ; port M2_RX.PER0_P
PER1_N: J10.30 ; port M2_RX.PER1_N
PER1_P: J10.32 ; port M2_RX.PER1_P
PER2_N: J10.18 ; port M2_RX.PER2_N
PER2_P: J10.20 ; port M2_RX.PER2_P
PER3_N: J10.6 ; port M2_RX.PER3_N
PER3_P: J10.8 ; port M2_RX.PER3_P
PERST#: J10.49 ; port M2_PERST#
PET0_N: J10.48 ; port M2_TX.PET0_N
PET0_P: J10.50 ; port M2_TX.PET0_P
PET1_N: J10.36 ; port M2_TX.PET1_N
PET1_P: J10.38 ; port M2_TX.PET1_P
PET2_N: J10.24 ; port M2_TX.PET2_N
PET2_P: J10.26 ; port M2_TX.PET2_P
PET3_N: J10.12 ; port M2_TX.PET3_N
PET3_P: J10.14 ; port M2_TX.PET3_P
REFCLK_N: J10.54 ; port M2_REFCLK_N
REFCLK_P: J10.56 ; port M2_REFCLK_P

Not connected (* = marked no-connect by the designer): J10 1* 7* 9* 11* 21* 23* 25* 27* 29* 31* 33* 35* 37* 39* 41* 43* 45* 47* 51* 53* 55* 57* 67* 68* 75*

### Layout directives
differential pair; differential pair class PCIe: PER0_N, PER0_P, PER1_N, PER1_P, PER2_N, PER2_P, PER3_N, PER3_P, PET0_N, PET0_P, PET1_N, PET1_P, PET2_N, PET2_P, PET3_N, PET3_P, REFCLK_N, REFCLK_P

### Notes on the sheet
- Main Board
- (near J10) Custom Pinout

### Library data of the parts
R95 = RES 0.01 OHM 1% 1/4W 0603: Tolerance: 1%; Power Rating: 0.25W; Supplier 1: Digi-Key; Supplier Part Number 1: 408-1404-1-ND; Value: 0.01; Package: 0603
TP45 TP46 = TP KEYSTONE 5015: Supplier 1: Digi-Key; Supplier Part Number 1: 36-5015CT-ND
J10 = CONN M.2 Key M FEMALE: Supplier 1: Digi-Key; Supplier Part Number 1: A124992CT-ND

## Nets that join several sheets
+3V3: FE (Q1.2 Q2.2 R20.2 R21.2), CH1 (7 pins), CH2 (7 pins), CH3 (7 pins), CH4 (7 pins), ADC (9 pins), M2_KEY_M (R95.2 TP46.1)
+4V8: FE (12 pins), CH1 (17 pins), CH2 (17 pins), CH3 (17 pins), CH4 (17 pins)
-2V5_REF: FE (TP19.1 U5.2 U5.6), CH1 (C28A.1 R47A.1), CH2 (C28B.1 R47B.1), CH3 (C28C.1 R47C.1), CH4 (C28D.1 R47D.1)
-4V8: FE (5 pins), CH1 (13 pins), CH2 (13 pins), CH3 (13 pins), CH4 (13 pins)
GND: FE (19 pins), CH1 (48 pins), CH2 (48 pins), CH3 (48 pins), CH4 (48 pins), ADC (35 pins), M2_KEY_M (16 pins)
PGA_SCLK: FE (TP17.1), CH1 (U7A.11), CH2 (U7B.11), CH3 (U7C.11), CH4 (U7D.11)
PGA_SDIO: FE (TP18.1), CH1 (U7A.10), CH2 (U7B.10), CH3 (U7C.10), CH4 (U7D.10)
TRIM1: FE (R15.1), CH1 (5 pins)
TRIM2: FE (R17.1), CH2 (5 pins)
TRIM3: FE (R18.1), CH3 (5 pins)
TRIM4: FE (R19.1), CH4 (5 pins)
VCM: FE (TP16.1), CH1 (U7A.13), CH2 (U7B.13), CH3 (U7C.13), CH4 (U7D.13)